# EAGLE design Extender (EAGLE 6.4)
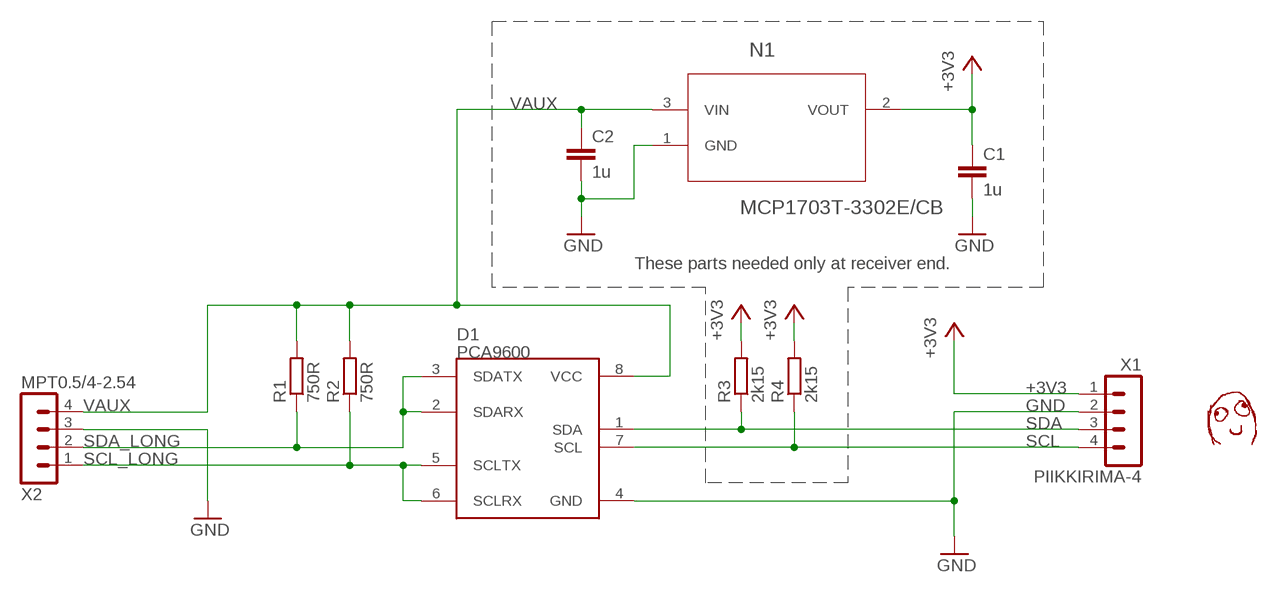
[diagram p0: schematic, sheet 1]

## Parts
C1  1u  C-EUC0805  [C0805]
C2  1u  C-EUC0805  [C0805]
D1  PCA9600  [SOP65P490X110-8N]
N1  MCP1703T-3302E/CB  [SOT95P300X145-3N]
R1  750R  R-EU_R0603  [R0603]
R2  750R  R-EU_R0603  [R0603]
R3  2k15  R-EU_R0603  [R0603]
R4  2k15  R-EU_R0603  [R0603]
U$1  DAFUG  [DAFUG]
X1  PIIKKIRIMA-4  [PIIKKIRIMA-4]
X2  MPT0.5/4-2.54  [MPT0.5/4-2.54]

## Nets
+3V3: C1.1 N1.2(VOUT) R3.2 R4.2 X1.1
GND: C1.2 C2.2 D1.4(GND) N1.1(GND) X1.2 X2.3
SCL: D1.7(SCL) R4.1 X1.4
SCL_LONG: D1.5(SCLTX) D1.6(SCLRX) R2.1 X2.1
SDA: D1.1(SDA) R3.1 X1.3
SDA_LONG: D1.2(SDARX) D1.3(SDATX) R1.1 X2.2
VAUX: C2.1 D1.8(VCC) N1.3(VIN) R1.2 R2.2 X2.4

## Notes on the sheet
- These parts needed only at receiver end.

## Library data of the parts
C1 C2 = rcl:C-EU: CAPACITOR, European symbol
D1 = OMAT_IC:PCA9600
N1 = Microchip_By_element14_Batch_1:MCP1703T-3302E/CB: Low Quiescent Current LDO Regulator; MPN: MCP1703T-3302E/CB; OC_FARNELL: 1439518; OC_NEWARK: 40M0637; PACKAGE: SOT-3; SUPPLIER: Microchip
R1-R4 = rcl:R-EU_: RESISTOR, European symbol
U$1 = dafug:DAFUG
X1 = OMAT_IC:PIIKKIRIMA-4
X2 = OMAT_IC:MPT0.5/4-2.54

## Board
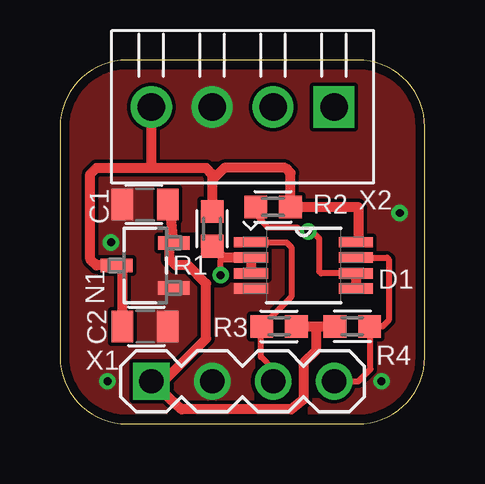
[diagram p1: board, top side]
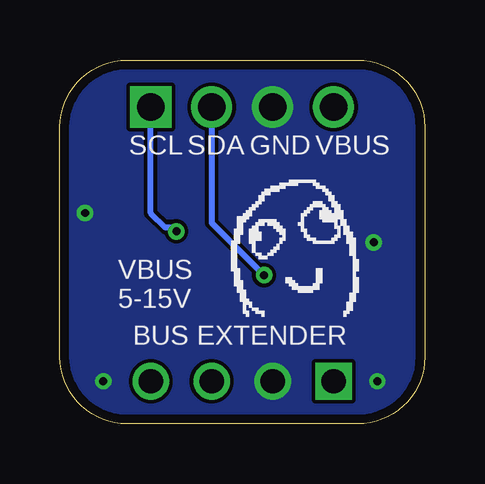
[diagram p2: board, bottom side, seen from below]

Size 15.22 x 15.16 mm. Coordinates in mm from the lower left corner, seen from the top.
Outline: 0,12.37 0,2.79 arc90 2.79,0 12.43,0 arc90 15.22,2.79 15.22,12.37 arc90 12.43,15.16 2.79,15.16 arc90 0,12.37
Copper layers (1*16): Top 0.0356mm / dielectric 1.5011mm / Bottom 0.0356mm
Design rules "LaenPCBOrder": minimum track width 6mil, minimum drill 13mil, track to track 6mil, track to pad 6mil, pad to pad 6mil, via to via 6mil, smd to smd 6mil, copper to edge 15mil, drill to drill 6mil, minimum pad ring 7mil, minimum via ring 7mil, stop-mask expansion 4mil, vias tented up to drill 0mil, thermal gap 10mil

### Footprints (pad centres in the part's own frame; a part is rotated, then mirrored left to right if it is on the bottom)
C0805 = smd 0.9 x 1.3: 1 -0.95,0; 2 0.95,0
SOP65P490X110-8N = smd 1.422 x 0.432: 1 -2.184,0.965; 2 -2.184,0.33; 3 -2.184,-0.33; 4 -2.184,-0.965; 5 2.184,-0.965; 6 2.184,-0.33; 7 2.184,0.33; 8 2.184,0.965
SOT95P300X145-3N = smd 0.559 x 1.321: 1 -0.94,-1.194; 2 0.94,-1.194; 3 0,1.194
R0603 = smd 0.95 x 0.95: 1 -0.725,0; 2 0.725,0
PIIKKIRIMA-4 = drill 1.016 square: 1 0,0 | drill 1.016: 2 2.54,0; 3 5.08,0; 4 7.62,0
MPT0.5/4-2.54 = drill 1.143 square: 1 0,0 | drill 1.143: 2 2.54,0; 3 5.08,0; 4 7.62,0

### Placement (x,y rotation side)
C1  3.56,9.14 180 top
C2  3.56,4.06 0 top
D1  10.16,6.6 0 top
N1  3.56,6.6 90 top
R1  6.35,8.13 90 top
R2  8.89,9.04 0 top
R3  9.14,4.06 0 top
R4  12.19,4.06 180 top
U$1  5.23,7.06 0 bottom
X1  3.81,1.78 0 top
X2  11.43,13.21 180 top

### Tracks (layer width: path | path; a pad name or v marks a point on that pad's centre or on a via)
+3V3
  Top 0.406: C1.1 4.6,9.05 N1.2 4.57,7.52 4.57,6.86 4.83,6.6 5.33,6.6 6.1,5.84 6.1,3.56 4.32,1.78 X1.1 5.08,0.61 9.65,0.61 10.16,1.02 10.16,2.54 10.67,3.05 10.67,4.06 | 10.67,4.06 R4.2 | R3.2 10.67,4.06
GND  (via drill 0.33)
  other vias: 13.41,1.78 1.98,1.78 2.13,7.57 14.17,8.79
  pour Top (no thermals): 0,14.99 14.73,14.99 15.24,14.73 15.24,0 0,0
  pour Bottom (no thermals): 0,14.99 15.24,14.99 15.24,0 0,0
SCL
  Top 0.254: X1.4 12.45,1.78 12.95,2.29 12.95,4.03 R4.1 13.46,4.06 13.72,4.32 13.72,6.86 13.64,6.93 D1.7
SCL_LONG  (via drill 0.33)
  Top 0.254: D1.6 10.9,6.27 10.82,6.35 10.82,7.72 10.52,8.03 v10.36,8.03 10.06,8.03 9.91,8.18 8.69,8.18 8.23,8.67 R2.1
  Top 0.406: D1.6 D1.5
  Bottom 0.254: v10.36,8.03 10.52,8.18 10.82,8.18 11.43,8.79 X2.1
SDA
  Top 0.254: X1.3 8.89,2.29 8.38,2.79 8.38,4.03 R3.1 9.65,5.3 9.65,7.37 9.45,7.57 D1.1
SDA_LONG  (via drill 0.33)
  Top 0.254: v6.71,6.2 6.71,6.82 6.82,6.93
  Top 0.406: D1.3 D1.2 6.82,6.93 R1.1
  Bottom 0.254: X2.2 8.89,8.38 v6.71,6.2
VAUX
  Top 0.406: D1.8 12.45,7.67 12.45,9.04 R2.2 9.62,10.45 9.4,10.67 6.86,10.67 6.35,10.16 | C2.1 2.61,6.51 N1.3 1.52,6.6 1.27,6.86 1.27,10.41 1.52,10.67 3.66,10.67 | 3.66,10.67 6.1,10.67 6.35,10.41 6.35,10.16 | 6.35,10.16 R1.2 | X2.4 3.81,10.82 3.66,10.67

### Text on the board
bPlace: VBUS | GND | SDA | SCL | VBUS / 5-15V | BUS EXTENDER